# Altium schematic sheet eps_32m1.SchDoc
size A4
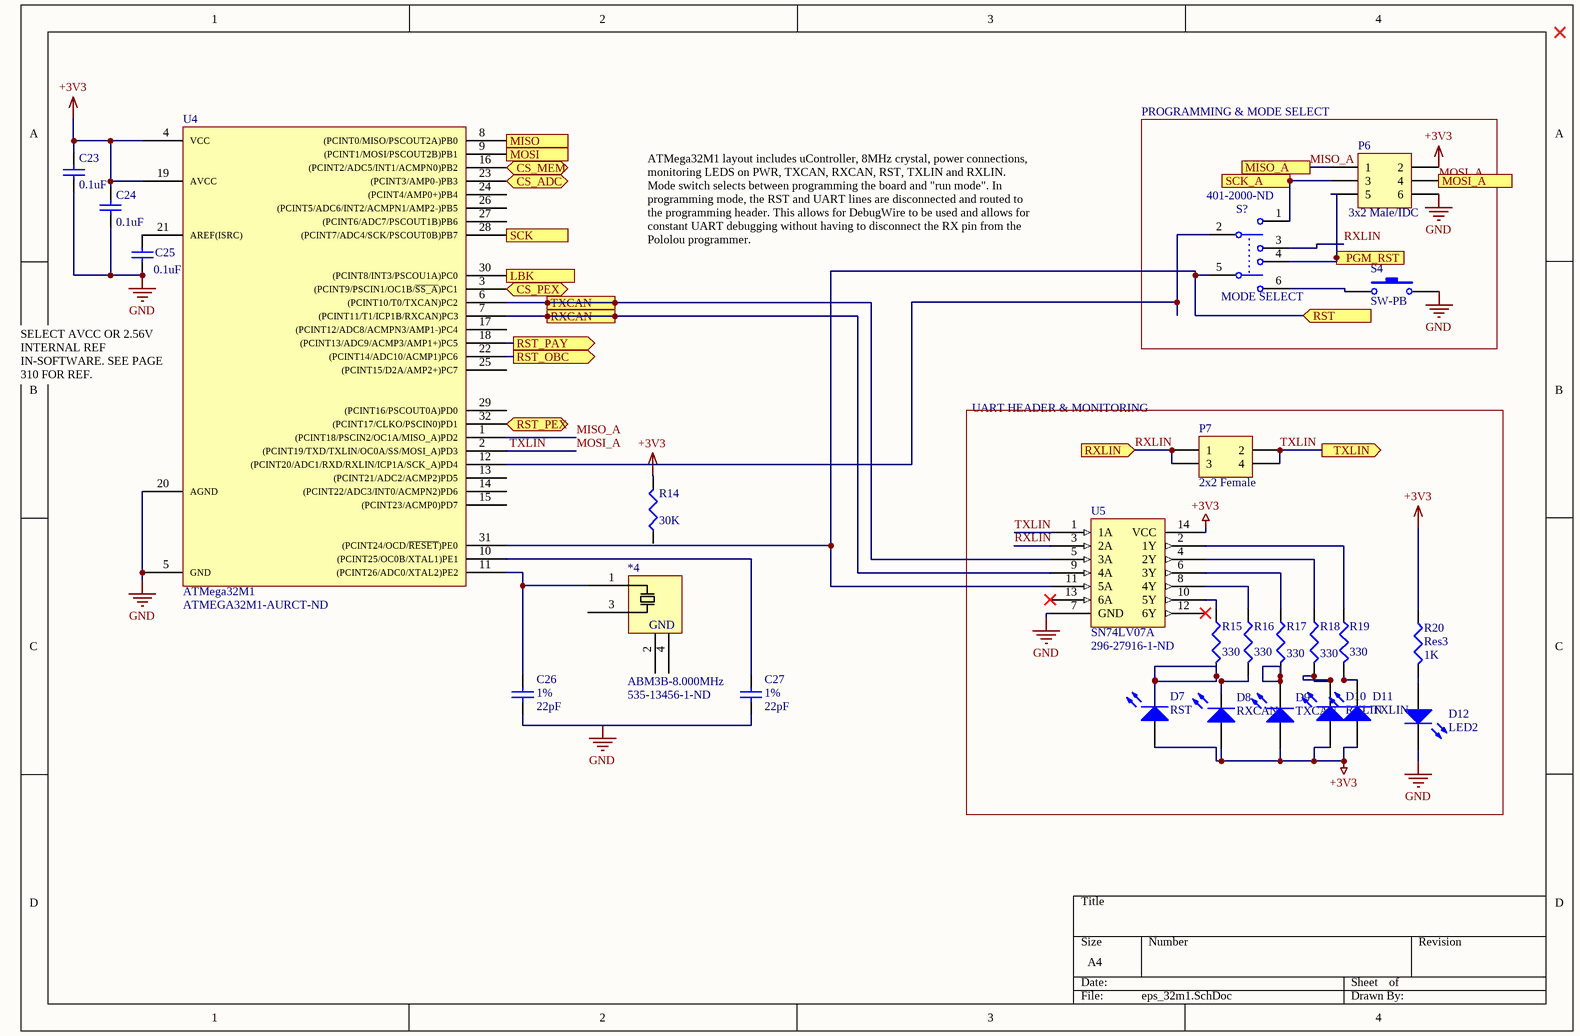
[diagram p0: eps_32m1.SchDoc]

## Parts
*4  ABM3B-8.000MHz  Supplier Part Number 1: 535-13456-1-ND  [OSCSC500X320X110-4N]
C23  value 0.1uF  [1608[0603]]  (hidden comment: Cap Semi)
C24  value 0.1uF  [1608[0603]]  (hidden comment: Cap Semi)
C25  value 0.1uF  [1608[0603]]  (hidden comment: Cap Semi)
C26  1%  value 22pF  [1608[0603]]
C27  1%  value 22pF  [1608[0603]]
D7  RST  [1608[0603]]
D8  RXCAN  [1608[0603]]
D9  TXCAN  [1608[0603]]
D10  RXLIN  [1608[0603]]
D11  TXLIN  [1608[0603]]
D12  LED2  [1608[0603]]
P6  3x2 Male/IDC  [HDR2X3]
P7  2x2 Female  [HDR2X2]
R14  value 30K  [J1-0603]
R15  value 330  [J1-0603]  (hidden comment: Res3)
R16  value 330  [J1-0603]  (hidden comment: Res3)
R17  value 330  [J1-0603]  (hidden comment: Res3)
R18  value 330  [J1-0603]  (hidden comment: Res3)
R19  value 330  [J1-0603]  (hidden comment: Res3)
R20  Res3  value 1K  [J1-0603]
S4  SW-PB  [SW415-ND]
S?  MODE SELECT  Supplier Part Number: 401-2000-ND  [DPST_32m1_switch]
U4  ATMega32M1  Supplier Part Number 1: ATMEGA32M1-AURCT-ND  [QFP80P900X900X120-32N]
U5  SN74LV07A  Supplier Part Number: 296-27916-1-ND  [SOP65P640X120-14N]

## Blocks framed on the sheet
PROGRAMMING & MODE SELECT: P6 S4 S?
UART HEADER & MONITORING: D7-D12 P7 R15-R20 U5

## Ports
CS_ADC (bidir), CS_MEM (bidir), CS_PEX (bidir), LBK, MISO (in), MISO_A, MOSI (out), MOSI_A, PGM_RST, RST (in), RST_OBC (out), RST_PAY (out), RST_PEX (bidir), RXCAN, RXLIN (in), SCK (out), SCK_A, TXCAN, TXLIN (out)

## Nets
+3V3: C23.2 C24.2 D7.1(A) D8.1(A) D9.1(A) D10.1(A) D11.1(A) P6.2 R14.2 R20.1 U4.4(VCC) U4.19(AVCC) U5.14(VCC)
GND: C23.1 C24.1 C25.2 D12.2(K) P6.6 S4.2 U4.5(GND) U4.20(AGND) U5.7(GND)
CS_ADC: U4.23((PCINT3/AMP0-)PB3) ; port CS_ADC
CS_MEM: U4.16((PCINT2/ADC5/INT1/ACMPN0)PB2) ; port CS_MEM
CS_PEX: U4.3((PCINT9/PSCIN1/OC1B/~{SS_A})PC1) ; port CS_PEX
LBK: U4.30((PCINT8/INT3/PSCOU1A)PC0) ; port LBK
MISO: U4.8((PCINT0/MISO/PSCOUT2A)PB0) ; port MISO
MISO_A: P6.1 U4.1((PCINT18/PSCIN2/OC1A/MISO_A)PD2) ; port MISO_A
MOSI: U4.9((PCINT1/MOSI/PSCOUT2B)PB1) ; port MOSI
MOSI_A: P6.4 P7.2 P7.4 U4.2((PCINT19/TXD/TXLIN/OC0A/SS/MOSI_A)PD3) U5.1(1A) ; port TXLIN, port MOSI_A  [also labelled TXLIN]
PGM_RST: P6.5 S?.4 ; port PGM_RST
RST: S?.5 U4.31((PCINT24/OCD/~{RESET})PE0) U5.11(5A) ; port RST
RST_OBC: U4.22((PCINT14/ADC10/ACMP1)PC6) ; port RST_OBC
RST_PAY: U4.18((PCINT13/ADC9/ACMP3/AMP1+)PC5) ; port RST_PAY
RST_PEX: U4.32((PCINT17/CLKO/PSCIN0)PD1) ; port RST_PEX
RXCAN: U4.7((PCINT11/T1/ICP1B/RXCAN)PC3) U5.9(4A) ; port RXCAN
RXLIN: P7.1 P7.3 S?.3 U5.3(2A) ; port RXLIN
SCK: U4.28((PCINT7/ADC4/SCK/PSCOUT0B)PB7) ; port SCK
SCK_A: P6.3 S?.1 ; port SCK_A
TXCAN: U4.6((PCINT10/T0/TXCAN)PC2) U5.5(3A) ; port TXCAN
Net*4_1: *4.1(IN) C26.2 U4.11((PCINT26/ADC0/XTAL2)PE2)
NetC25_1: C25.1 U4.21(AREF(ISRC))
NetC26_1: C26.1 C27.1
NetC27_2: C27.2 U4.10((PCINT25/OC0B/XTAL1)PE1)
NetD7_2: D7.2(K) R15.2
NetD8_2: D8.2(K) R16.2
NetD9_2: D9.2(K) R17.2
NetD10_2: D10.2(K) R18.2
NetD11_2: D11.2(K) R19.2
NetD12_1: D12.1(A) R20.2
NetR15_1: R15.1 U5.10(5Y)
NetR16_1: R16.1 U5.8(4Y)
NetR17_1: R17.1 U5.6(3Y)
NetR18_1: R18.1 U5.4(2Y)
NetR19_1: R19.1 U5.2(1Y)
NetS4_1: S4.1 S?.6
NetS?_2: S?.2 U4.12((PCINT20/ADC1/RXD/RXLIN/ICP1A/SCK_A)PD4)

Not connected (* = marked no-connect by the designer): *4 2(5) 3(IN) 4; R14 1; U4 13((PCINT21/ADC2/ACMP2)PD5) 14((PCINT22/ADC3/INT0/ACMPN2)PD6) 15((PCINT23/ACMP0)PD7) 17((PCINT12/ADC8/ACMPN3/AMP1-)PC4) 24((PCINT4/AMP0+)PB4) 25((PCINT15/D2A/AMP2+)PC7) 26((PCINT5/ADC6/INT2/ACMPN1/AMP2-)PB5) 27((PCINT6/ADC7/PSCOUT1B)PB6) 29((PCINT16/PSCOUT0A)PD0); U5 12(6Y)* 13(6A)*

## Notes on the sheet
- ATMega32M1 layout includes uController, 8MHz crystal, power connections, monitoring LEDS on PWR, TXCAN, RXCAN, RST, TXLIN and RXLIN. Mode switch selects between programming the board and "run mode". In programming mode, the RST and UART lines are disconnected and routed to the programming header. This allows for DebugWire to be used and allows for constant UART debugging without having to disconnect the RX pin from the Pololou programmer.
- (near U4) SELECT AVCC OR 2.56V INTERNAL REF IN-SOFTWARE. SEE PAGE 310 FOR REF.
- Labels drawn without touching a wire or pin: GND
- (in symbol AMB3B-8MHz) GND

## Library data of the parts
*4 = AMB3B-8MHz: 8MHz Abracom 4-pin crystal. Pin 1: XTAL1, Pin 2/4: GND, Pin 3: XTAL2.; Supplier 1: Digi-Key
C23-C27 = Cap Semi: Capacitor (Semiconductor SIM Model); Published: 8-Jun-2000; LatestRevisionDate: 29-May-2009; LatestRevisionNote: IPC-7351 Footprint Added.; PackageReference: C1206; Publisher: Altium Limited; PackageDescription: Chip Capacitor
D7-D12 = LED2: Typical RED, GREEN, YELLOW, AMBER GaAs LED; Published: 8-Jun-2000; LatestRevisionDate: 17-Jul-2002; LatestRevisionNote: Re-released for DXP Platform.; PackageVersion: Feb-2002; PackageReference: 3.2X1.6X1.1; Publisher: Altium Limited; PackageDescription: SM LED; 2 Flat Leads
P6 = Header 3X2: 2x3 through-hole programming header, IDC; LatestRevisionDate: 17-Jul-2002; LatestRevisionNote: Re-released for DXP Platform.; Publisher: Altium Limited
P7 = Header 2X2: Header, 2-Pin, Dual row; LatestRevisionDate: 17-Jul-2002; LatestRevisionNote: Re-released for DXP Platform.; Publisher: Altium Limited
R14 = Res3: 30K Pull-up resistor for RST. See page; Published: 8-Jun-2000; LatestRevisionDate: 29-May-2009; LatestRevisionNote: IPC-7351 Footprint Added.; PackageReference: J1-0603; Publisher: Altium Limited; PackageDescription: Chip Resistor
R15-R20 = Res3: Resistor; Published: 8-Jun-2000; LatestRevisionDate: 29-May-2009; LatestRevisionNote: IPC-7351 Footprint Added.; PackageReference: J1-0603; Publisher: Altium Limited; PackageDescription: Chip Resistor
S4 = SW-PB: Switch; Published: 24-Mar-1999; LatestRevisionDate: 17-Jul-2002; LatestRevisionNote: Re-released for DXP Platform.; PackageReference: SPST-2; Publisher: Altium Limited; PackageDescription: Switch; 2 Leads
S? = SW-DPDT: Double-Pole, Double-Throw Switch; Published: 24-Mar-1999; LatestRevisionDate: 17-Jul-2002; LatestRevisionNote: Re-released for DXP Platform.; PackageReference: DPDT-6; Publisher: Altium Limited; PackageDescription: Switch; 6 Leads; Supplier: Digi-Key
U4 = ATMega32M1: Atmel 8-bit AVR microcontroller.; Supplier 1: Digi-Key
U5 = SN74LV07A: Six element 1-bit non-inverting open-drain buffer.; Supplier: Digi-Key